# Altium schematic sheet Connector_Sheet.SchDoc
size 420 x 297 mm; SheetNumber: 10; SheetTotal: 10
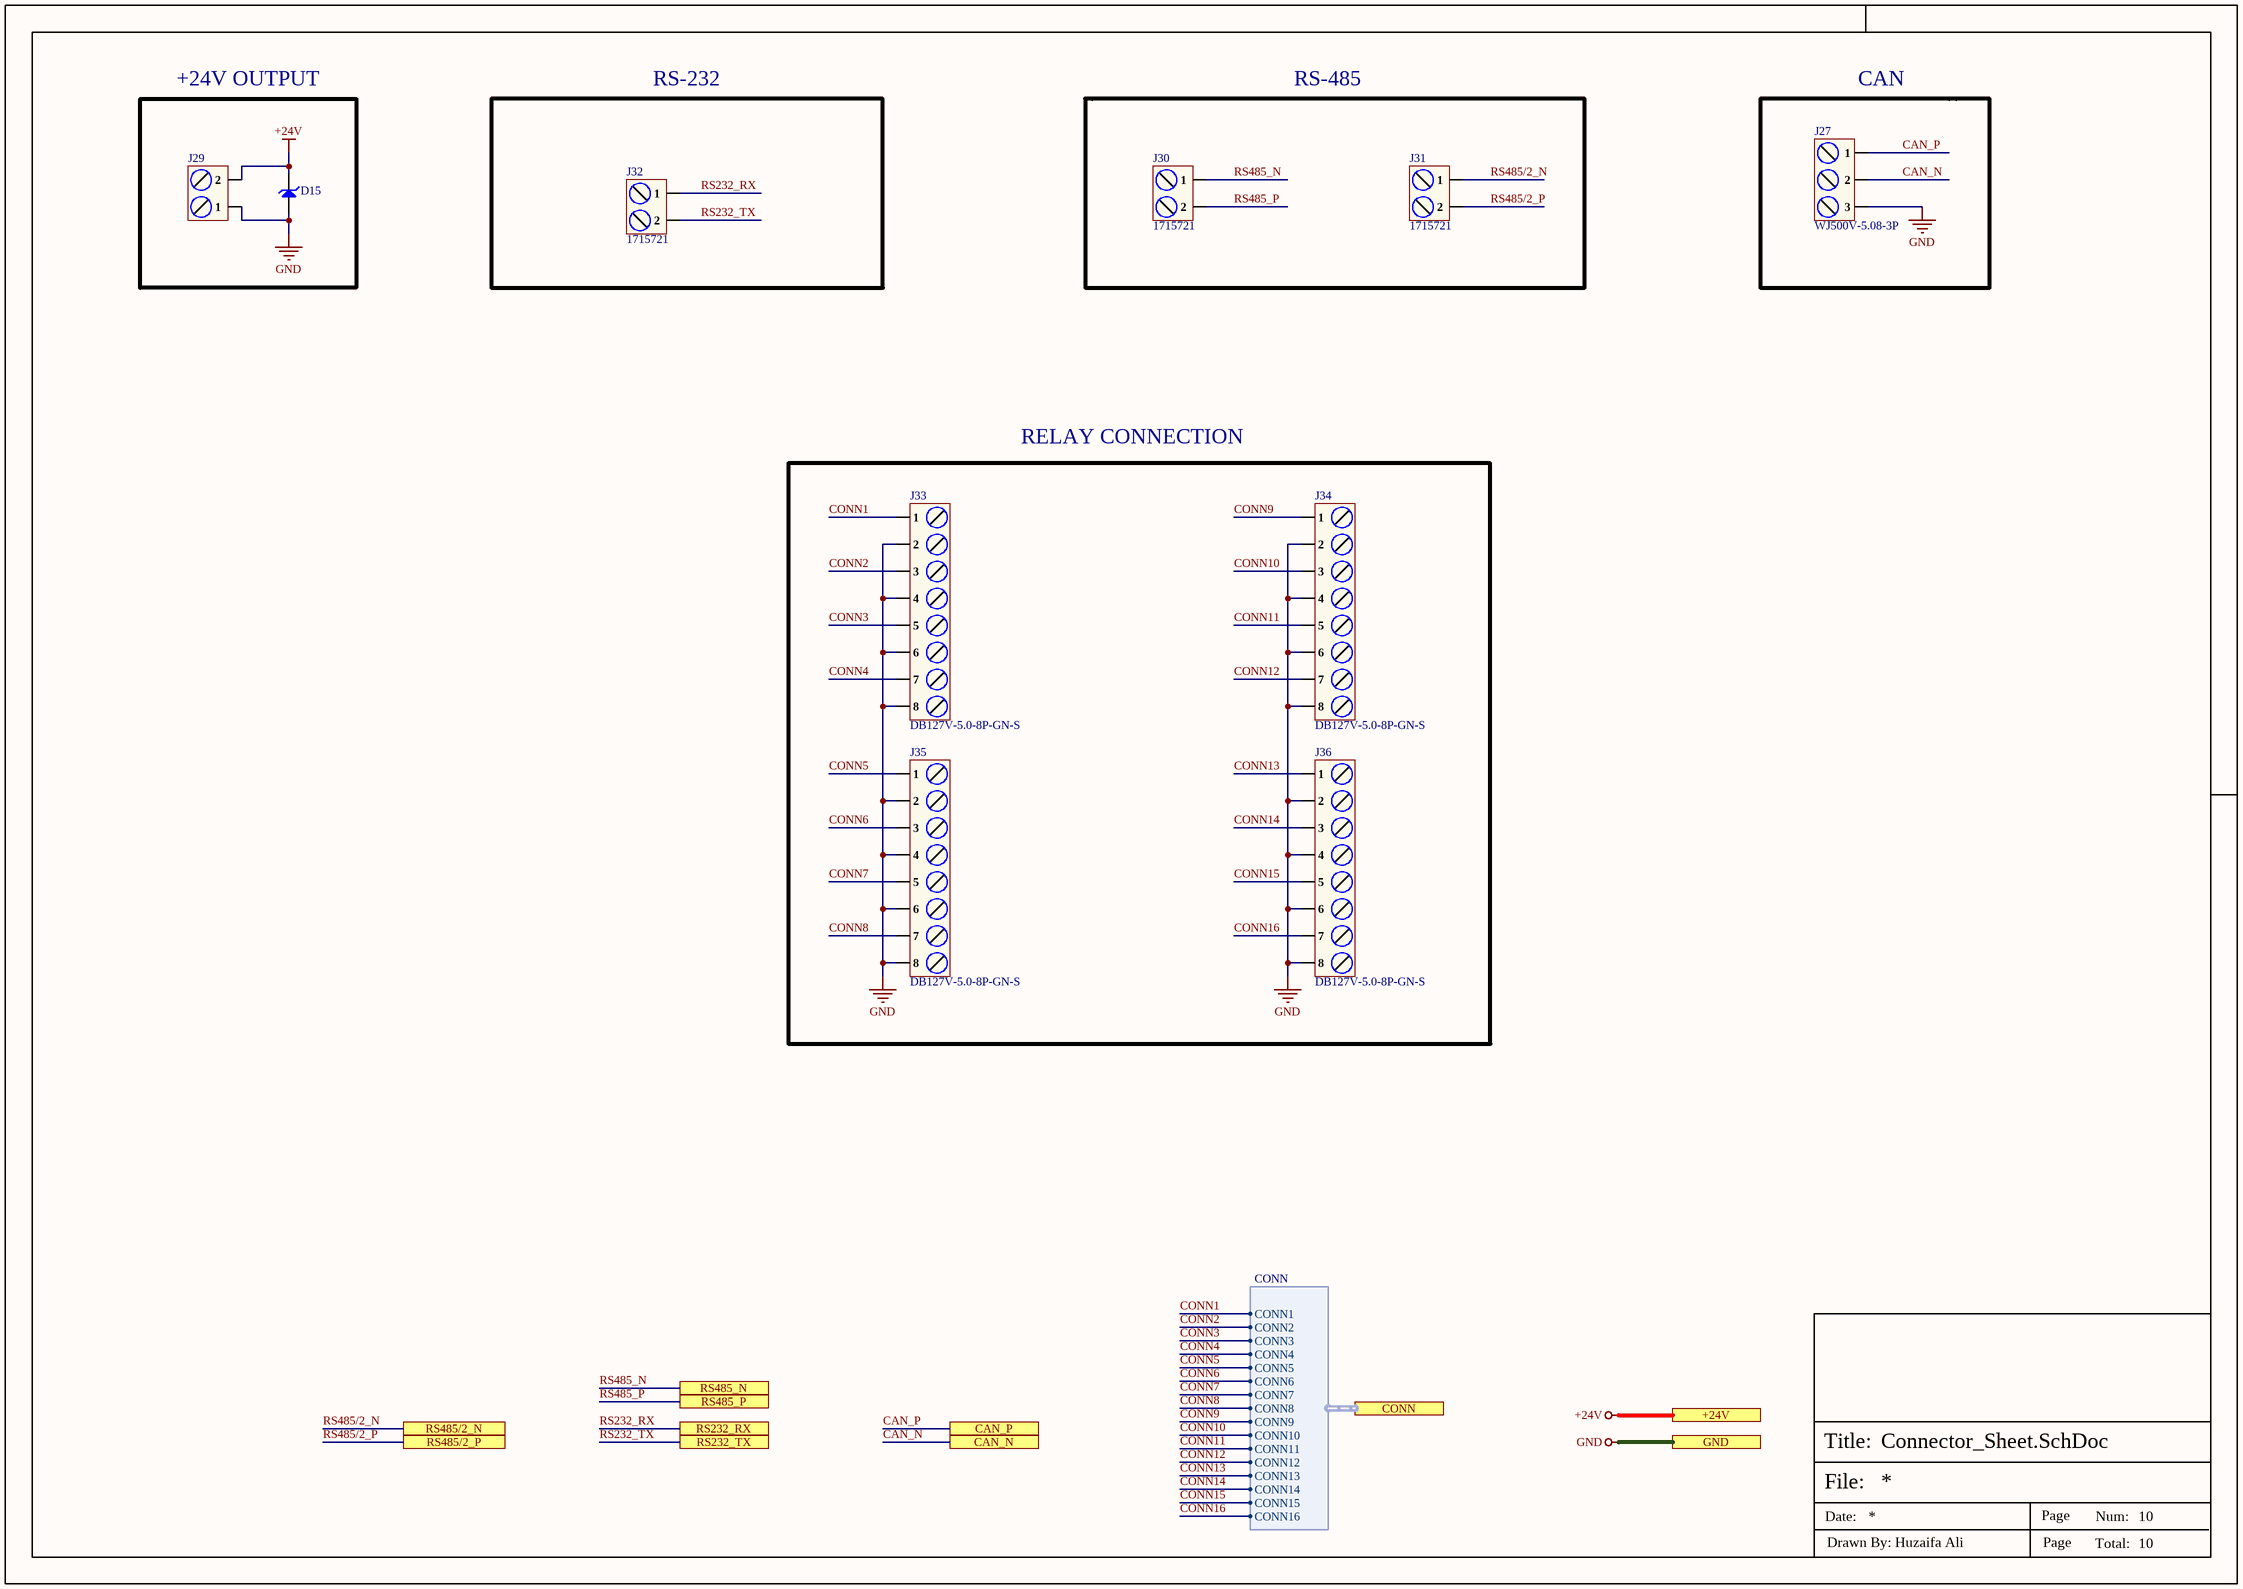
[diagram p0: Connector_Sheet.SchDoc]

## Parts
D15  SMBJ28A-13-F  [SMB_]  (value not drawn)
J27  WJ500V-5.08-3P  [WJ500V-5.08-3P]
J29  MXHB9500-9.5-02P-BK01-Cu-S-A  [MXHB9500-9.5-02P-BK01-Cu-S-A]  (value not drawn)
J30  1715721  [1715721]
J31  1715721  [1715721]
J32  1715721  [1715721]
J33  DB127V-5.0-8P-GN-S  [DB127V-5.0-8P-GN-S]
J34  DB127V-5.0-8P-GN-S  [DB127V-5.0-8P-GN-S]
J35  DB127V-5.0-8P-GN-S  [DB127V-5.0-8P-GN-S]
J36  DB127V-5.0-8P-GN-S  [DB127V-5.0-8P-GN-S]

## Ports
+24V (see Top_Sheet[2A], Power_Sheet[5D], Relay_PWR_Sheet[5D], Relay_Sheet[5D]), CAN_N (see Top_Sheet[3A], CAN_Sheet[3D]), CAN_P (see Top_Sheet[3A], CAN_Sheet[3D]), CONN (harness CONN, see Top_Sheet[2B], Relay_Sheet[2D]), GND (see Top_Sheet[2A], CAN_Sheet[5D], Controller_Sheet[5D], EtherCAT_Sheet[5D], Power_Sheet[5D], Relay_Sheet[5D], RJ45_Sheet[5D], RS485_RS232_Sheet[5D]), RS232_RX (see Top_Sheet[3B], RS485_RS232_Sheet[2D]), RS232_TX (see Top_Sheet[3B], RS485_RS232_Sheet[2D]), RS485/2_N (see Top_Sheet[2B], RS485_RS232_Sheet[1D]), RS485/2_P (see Top_Sheet[2B], RS485_RS232_Sheet[1D]), RS485_N (see Top_Sheet[2B], RS485_RS232_Sheet[1D]), RS485_P (see Top_Sheet[2A], RS485_RS232_Sheet[1D])

## Harnesses
CONN: CONN1, CONN2, CONN3, CONN4, CONN5, CONN6, CONN7, CONN8, CONN9, CONN10, CONN11, CONN12, CONN13, CONN14, CONN15, CONN16

## Nets
+24V: D15.2(K) J29.2 ; port +24V
GND: D15.1(A) J27.3 J29.1 J33.2 J33.4 J33.6 J33.8 J34.2 J34.4 J34.6 J34.8 J35.2 J35.4 J35.6 J35.8 J36.2 J36.4 J36.6 J36.8 ; port GND
CAN_N: J27.2 ; port CAN_N
CAN_P: J27.1 ; port CAN_P
CONN1: J33.1 ; port CONN.CONN1
CONN2: J33.3 ; port CONN.CONN2
CONN3: J33.5 ; port CONN.CONN3
CONN4: J33.7 ; port CONN.CONN4
CONN5: J35.1 ; port CONN.CONN5
CONN6: J35.3 ; port CONN.CONN6
CONN7: J35.5 ; port CONN.CONN7
CONN8: J35.7 ; port CONN.CONN8
CONN9: J34.1 ; port CONN.CONN9
CONN10: J34.3 ; port CONN.CONN10
CONN11: J34.5 ; port CONN.CONN11
CONN12: J34.7 ; port CONN.CONN12
CONN13: J36.1 ; port CONN.CONN13
CONN14: J36.3 ; port CONN.CONN14
CONN15: J36.5 ; port CONN.CONN15
CONN16: J36.7 ; port CONN.CONN16
RS232_RX: J32.1 ; port RS232_RX
RS232_TX: J32.2 ; port RS232_TX
RS485/2_N: J31.1 ; port RS485/2_N
RS485/2_P: J31.2 ; port RS485/2_P
RS485_N: J30.1 ; port RS485_N
RS485_P: J30.2 ; port RS485_P

## Notes on the sheet
- +24V OUTPUT
- RS-232
- RS-485
- CAN
- RELAY CONNECTION
- File:
- Title:
- Date:
- Page
- Num:
- Total:
- Drawn By: Huzaifa Ali

## Library data of the parts
D15 = SMBJ28A-13-F: TVS DIODE 28VWM 45.4VC SMB; Manufacturer: Diodes; Test Current: 1mA; Number of Elements: 1; Power Dissipation: 600W; Forward Voltage: 5V; Direction: Unidirectional; Reverse Breakdown Voltage: 31.1V; Max Surge Current: 13.2A; Reverse Standoff Voltage: 28V; Clamping Voltage: 45.4V; Power Line Protection: No; Breakdown Voltage: 35.8V; Max Reverse Leakage Current: 5uA; Value: 330pF; Diode Type: ZENER; Supplier: Future Electronics; Supplier Part Number: 8797342; Manufacturer Part Number: SMBJ28A-13-F; RoHS: Yes; Category: TVS Diodes; Stock: 39000; Pricing: 3000=0.0734, 9000=0.0706, 15000=0.0693, 30000=0.0676, 60000=0.065 (USD); Mounting Technology: Surface Mount; Case/Package: SMB; Pins: 2; Min Operating Temperature: -55°C; Max Operating Temperature: 150°C; Packaging: Tape and Reel; Package Quantity: 3000; Max Power Dissipation: 600W; Series: SMBJ; Number of Unidirectional Channels: 1; Min Breakdown Voltage: 31.1V; Peak Pulse Power: 600W; Polarity: Unidirectional; Termination: SMD/SMT; Peak Pulse Current: 13.2A; Max Breakdown Voltage: 35.8V; Leakage Current: 5uA; Working Voltage: 28V; Voltage Rating (DC): 28V; Max Output current: 13.2A; Clamping Voltage-Max: 45.4V; Length: 4.57mm; Width: 3.9mm; Height: 2.62mm; Radiation Hardening: No; RoHS Compliant: Yes; Lead Free: Lead Free; ComponentLink1URL: https://datasheet.ciiva.com/16387/ds19002-16387564.pdf?src-supplier=Future+Electronics; ComponentLink1Description: https://datasheet.ciiva.com/16387/ds19002-16387564.pdf?src-supplier=Future+Electronics; ComponentLink2URL: https://datasheet.ciiva.com/26912/getdatasheetpartid-234000-26912533.pdf?src-supplier=Verical; ComponentLink2Description: https://datasheet.ciiva.com/26912/getdatasheetpartid-234000-26912533.pdf?src-supplier=Verical; Item Type: Diode
J27 = WJ500V-5.08-3P: 1x3P 18A -40℃~+105℃ 250V Green 14~30 Straight pin 5.08mm 2.5 1 3 Plugin,P=5.08mm Screw terminal ROHS; Manufacturer: Ningbo Kangnex Elec; Item Type: Terminal Block; Manufacturer Part Number: WJ500V-5.08-3P; Package: Plugin,P=5.08mm; LCSC Part Number: C72334; ComponentLink1Description: LCSC; ComponentLink1URL: https://www.lcsc.com/product-detail/Screw-terminal_Ningbo-Kangnex-Elec-WJ500V-5-08-3P_C72334.html
J29 = MXHB9500-9.5-02P-BK01-Cu-S-A: Tin 1x2P Corner pin Three sides 2 1 9.5mm -40℃~+105℃ 20A 300V Black 10~22 Copper Alloy 0.5~4 Plugin,P=9.5mm Barrier Terminal Blocks ROHS; Manufacturer: MAX; Manufacturer Part Number: MXHB9500-9.5-02P-BK01-Cu-S-A; Package: Plugin,P=9.5mm; LCSC Part Number: C7542168; Item Type: Terminal Block; ComponentLink1Description: LCSC; ComponentLink1URL: https://www.lcsc.com/product-detail/Barrier-Terminal-Blocks_MAX-MXHB9500-9-5-02P-BK01-Cu-S-A_C7542168.html
J30-J32 = 1715721: TERM BLK 2P SIDE ENT 5.08MM PCB; Manufacturer: Phoenix Contact; Item Type: Terminal Blocks; Supplier: Digikey; Supplier Part Number: 277-1263-ND; Manufacturer Part Number: 1715721; RoHS: Yes; Stock: 13160; Pricing: 1=0.94 (USD); ComponentLink1URL: https://datasheet.ciiva.com/1120/1697161-1120393.pdf?src-supplier=Farnell; ComponentLink1Description: https://datasheet.ciiva.com/1120/1697161-1120393.pdf?src-supplier=Farnell; ComponentLink2URL: https://datasheet.ciiva.com/832/1715721-832095.pdf?src-supplier=Digikey; ComponentLink2Description: https://datasheet.ciiva.com/832/1715721-832095.pdf?src-supplier=Digikey; ComponentLink3URL: https://datasheet.ciiva.com/15169/getdatasheetpartid-212174-15169929.pdf?src-supplier=Verical; ComponentLink3Description: https://datasheet.ciiva.com/15169/getdatasheetpartid-212174-15169929.pdf?src-supplier=Verical; ComponentLink4URL: https://datasheet.ciiva.com/16046/1715721-16046034.pdf?src-supplier=Onlinecomponents.com; ComponentLink4Description: https://datasheet.ciiva.com/16046/1715721-16046034.pdf?src-supplier=Onlinecomponents.com
J33-J36 = DB127V-5.0-8P-GN-S: 1x8P -40℃~+105℃ 15A 250V Green 14~26 Straight 5mm 1.5 1 8 Plugin,P=5mm Screw Terminal Blocks ROHS; Manufacturer: DIBO; Supplier: LCSC; LCSC Part Number: C430626; Manufacturer Part Number: DB127V-5.0-8P-GN-S; RoHS: No; Item Type: Terminal Block